# Altium project as14120_x31.PrjPCB (part 1 of 3)
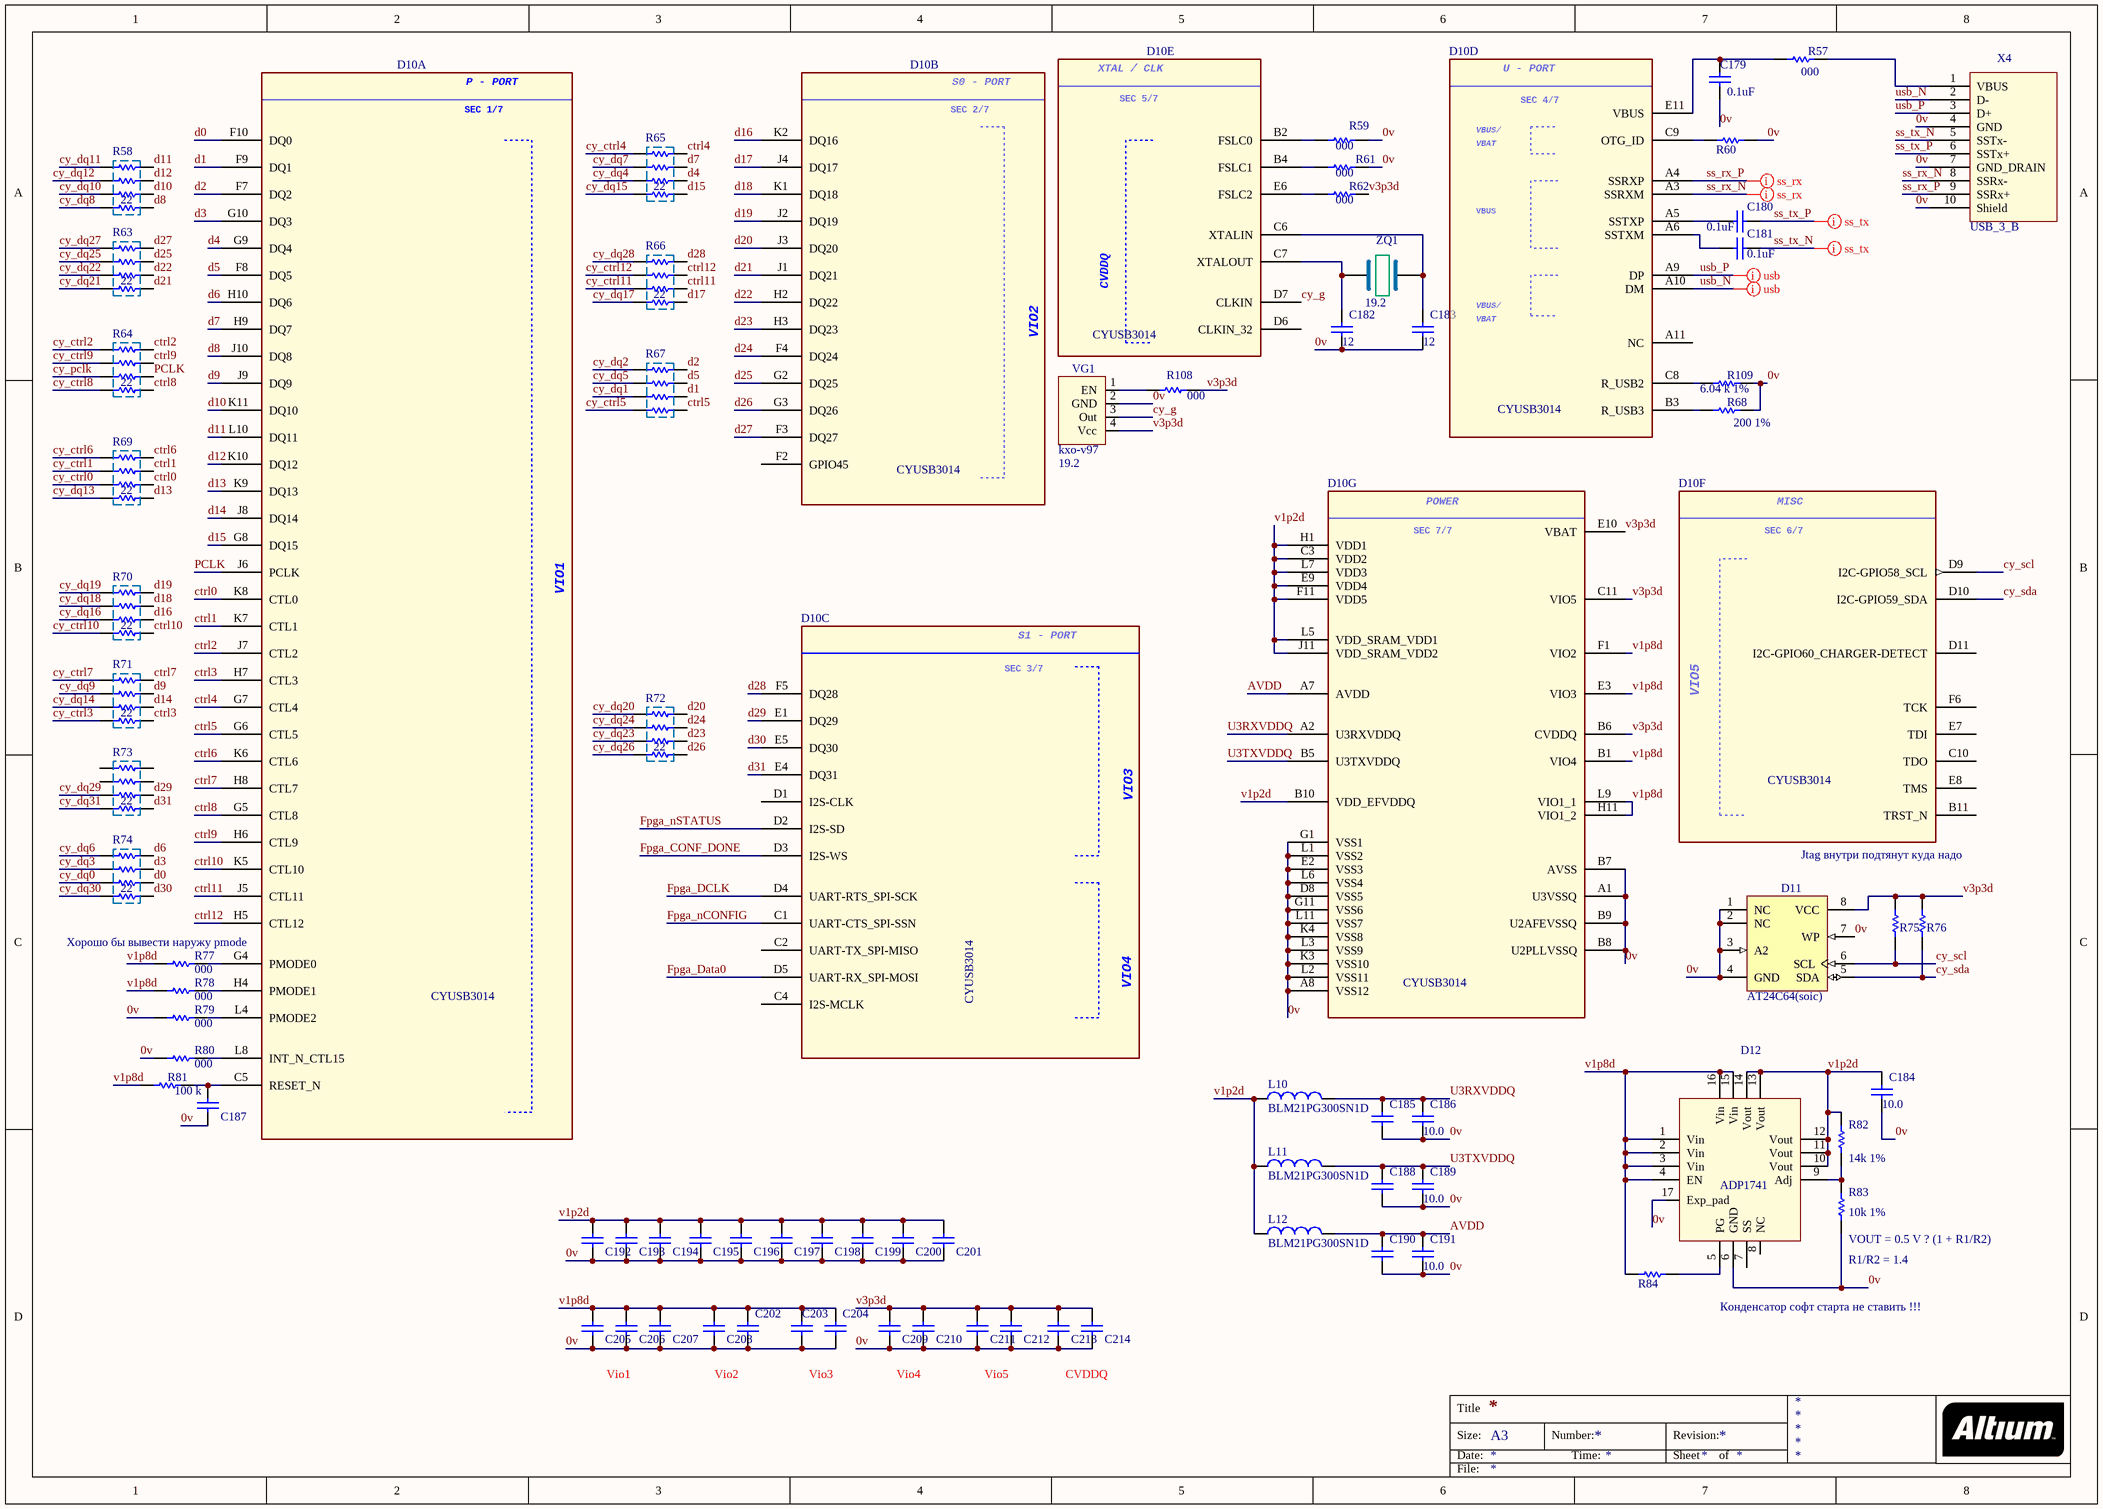
[diagram p0: as14120_x31_usb.SchDoc]
7 sheets, 344 parts. Net scope: global (net labels, ports and power ports of the same name join across sheets).
Board file: as_x31.PcbDoc
Sheets:
  as14120_x31_usb.SchDoc
  as14120_x31_fpga_ttl.SchDoc
  as14120_x31_fpga_power_conf.SchDoc
  as14120_x31_fpga_ddr.SchDoc
  as14120_x31_fpga_cypress.SchDoc
  as14120_x31_ddr.SchDoc
  as14120_x31_adc.SchDoc

## Sheet as14120_x31_usb.SchDoc
size A3; PageSetup: Record=PageOptions|CenterHorizontal=True|CenterVertical=True|PrintScale=1.02|XCorrection=1.00|YCorrection=1.00|PrintKind=0|BorderSize=5000000|LeftOffset=0|BottomOffset=0|Orientation=2|PaperLength=4200|PaperWidth=2970|Scale=100|PaperSource=7|PrintQuality=-4|MediaType=1|DitherType=10|PaperKind=A3 (бумага продольной резки) (297 x 420 мм)|PrintScaleMode=1

### Parts
C179  value 0.1uF  [CAPC0402(1005)60_M]  (hidden comment: CAP 1uF 10V 0402(1005))
C180  value 0.1uF  [CAPC0402(1005)60_M]  (hidden comment: CAP 1uF 10V 0402(1005))
C181  value 0.1uF  [CAPC0402(1005)60_M]  (hidden comment: CAP 1uF 10V 0402(1005))
C182  value 12  [CAPC0805(2012)100_N]  (hidden comment: CAP_0805)
C183  value 12  [CAPC0805(2012)100_N]  (hidden comment: CAP_0805)
C184  value 10.0  [CAPC0805(2012)100_N]  (hidden comment: CAP_0805)
C185  CAP 1uF 10V 0402(1005)  [CAPC0402(1005)60_M]  (value not drawn)
C186  value 10.0  [CAPC0805(2012)100_N]  (hidden comment: CAP_0805)
C187  CAP 1uF 10V 0402(1005)  [CAPC0402(1005)60_M]  (value not drawn)
C188  CAP 1uF 10V 0402(1005)  [CAPC0402(1005)60_M]  (value not drawn)
C189  value 10.0  [CAPC0805(2012)100_N]  (hidden comment: CAP_0805)
C190  CAP 1uF 10V 0402(1005)  [CAPC0402(1005)60_M]  (value not drawn)
C191  value 10.0  [CAPC0805(2012)100_N]  (hidden comment: CAP_0805)
C192  CAP 1uF 10V 0402(1005)  [CAPC0402(1005)60_M]  (value not drawn)
C193  CAP 1uF 10V 0402(1005)  [CAPC0402(1005)60_M]  (value not drawn)
C194  CAP 1uF 10V 0402(1005)  [CAPC0402(1005)60_M]  (value not drawn)
C195  CAP 1uF 10V 0402(1005)  [CAPC0402(1005)60_M]  (value not drawn)
C196  CAP 1uF 10V 0402(1005)  [CAPC0402(1005)60_M]  (value not drawn)
C197  CAP 1uF 10V 0402(1005)  [CAPC0402(1005)60_M]  (value not drawn)
C198  CAP 1uF 10V 0402(1005)  [CAPC0402(1005)60_M]  (value not drawn)
C199  CAP 1uF 10V 0402(1005)  [CAPC0402(1005)60_M]  (value not drawn)
C200  CAP 1uF 10V 0402(1005)  [CAPC0402(1005)60_M]  (value not drawn)
C201  CAP 1uF 10V 0402(1005)  [CAPC0402(1005)60_M]  (value not drawn)
C202  CAP 1uF 10V 0402(1005)  [CAPC0402(1005)60_M]  (value not drawn)
C203  CAP 1uF 10V 0402(1005)  [CAPC0402(1005)60_M]  (value not drawn)
C204  CAP 1uF 10V 0402(1005)  [CAPC0402(1005)60_M]  (value not drawn)
C205  CAP 1uF 10V 0402(1005)  [CAPC0402(1005)60_M]  (value not drawn)
C206  CAP 1uF 10V 0402(1005)  [CAPC0402(1005)60_M]  (value not drawn)
C207  CAP 1uF 10V 0402(1005)  [CAPC0402(1005)60_M]  (value not drawn)
C208  CAP 1uF 10V 0402(1005)  [CAPC0402(1005)60_M]  (value not drawn)
C209  CAP 1uF 10V 0402(1005)  [CAPC0402(1005)60_M]  (value not drawn)
C210  CAP 1uF 10V 0402(1005)  [CAPC0402(1005)60_M]  (value not drawn)
C211  CAP 1uF 10V 0402(1005)  [CAPC0402(1005)60_M]  (value not drawn)
C212  CAP 1uF 10V 0402(1005)  [CAPC0402(1005)60_M]  (value not drawn)
C213  CAP 1uF 10V 0402(1005)  [CAPC0402(1005)60_M]  (value not drawn)
C214  CAP 1uF 10V 0402(1005)  [CAPC0402(1005)60_M]  (value not drawn)
D10  CYUSB3014  [BGA121C80P11X11]  (parts A,B,C,D,E,F,G of 7)
D11  AT24C64(soic)  [8S1_N]
D12  ADP1741  [CP-16-4_N]
L10  BLM21PG300SN1D  [CAPC0805(2012)100_N]
L11  BLM21PG300SN1D  [CAPC0805(2012)100_N]
L12  BLM21PG300SN1D  [CAPC0805(2012)100_N]
R57  value 000  [RESC0805(2012)_L]  (hidden comment: 1K 1% 0805(2012))
R58  22  [CAY16]
R59  value 000  [RESC0603(1608)_L]  (hidden comment: 1K 5% 0603(1608))
R60  ???  [RESC0603(1608)_L]  (value not drawn)
R61  value 000  [RESC0603(1608)_L]  (hidden comment: 1K 5% 0603(1608))
R62  value 000  [RESC0603(1608)_L]  (hidden comment: 1K 5% 0603(1608))
R63  22  [CAY16]
R64  22  [CAY16]
R65  22  [CAY16]
R66  22  [CAY16]
R67  (no value)  [CAY16]
R68  value 200 1%  [RESC0805(2012)_L]  (hidden comment: 1K 1% 0805(2012))
R69  22  [CAY16]
R70  22  [CAY16]
R71  22  [CAY16]
R72  22  [CAY16]
R73  22  [CAY16]
R74  22  [CAY16]
R75  1K 5% 0603(1608)  [RESC0603(1608)_L]  (value not drawn)
R76  1K 5% 0603(1608)  [RESC0603(1608)_L]  (value not drawn)
R77  value 000  [RESC0603(1608)_L]  (hidden comment: 1K 5% 0603(1608))
R78  value 000  [RESC0603(1608)_L]  (hidden comment: 1K 5% 0603(1608))
R79  value 000  [RESC0603(1608)_L]  (hidden comment: 1K 5% 0603(1608))
R80  value 000  [RESC0603(1608)_L]  (hidden comment: 1K 5% 0603(1608))
R81  value 100 k  [RESC0603(1608)_L]  (hidden comment: 1K 5% 0603(1608))
R82  value 14k 1%  [RESC0805(2012)_L]  (hidden comment: 1K 1% 0805(2012))
R83  value 10k 1%  [RESC0805(2012)_L]  (hidden comment: 1K 1% 0805(2012))
R84  1K 5% 0603(1608)  [RESC0603(1608)_L]  (value not drawn)
R108  value 000  [RESC0603(1608)_L]  (hidden comment: 1K 5% 0603(1608))
R109  value 6.04 k 1%  [RESC0805(2012)_L]  (hidden comment: 1K 1% 0805(2012))
VG1  kxo-v97  value 19.2  [kxo-v97]
X4  USB_3_B  [USB3_B]
ZQ1  value 19.2  [BCY-W2/E4.7]  (hidden comment: Resonator)

### Nets
0v: C179.2 C182.1 C183.1 C184.1 C185.1 C186.1 C187.1 C188.1 C189.1 C190.1 C191.1 C192.1 C193.1 C194.1 C195.1 C196.1 C197.1 C198.1 C199.1 C200.1 C201.1 C202.1 C203.1 C204.1 C205.1 C206.1 C207.1 C208.1 C209.1 C210.1 C211.1 C212.1 C213.1 C214.1 D10.A1(U3VSSQ) D10.A8(VSS12) D10.B7(AVSS) D10.B8(U2PLLVSSQ) D10.B9(U2AFEVSSQ) D10.D8(VSS5) D10.E2(VSS3) D10.G1(VSS1) D10.G11(VSS6) D10.K3(VSS10) D10.K4(VSS8) D10.L1(VSS2) D10.L2(VSS11) D10.L3(VSS9) D10.L6(VSS4) D10.L11(VSS7) D11.1(NC) D11.2(NC) D11.3(A2) D11.4(GND) D11.7(WP) D12.6(GND) D12.17(Exp_pad) R59.1 R60.2 R61.1 R68.2 R79.2 R80.2 R83.1 R109.2 VG1.2(GND) X4.4(GND) X4.7(GND_DRAIN) X4.10(Shield)
AVDD: C190.2 C191.2 D10.A7(AVDD) L12.2
ctrl0: D10.K8(CTL0) R69.6
ctrl1: D10.K7(CTL1) R69.7
ctrl2: D10.J7(CTL2) R64.8
ctrl3: D10.H7(CTL3) R71.5
ctrl4: D10.G7(CTL4) R65.8
ctrl5: D10.G6(CTL5) R67.5
ctrl6: D10.K6(CTL6) R69.8
ctrl7: D10.H8(CTL7) R71.8
ctrl8: D10.G5(CTL8) R64.5
ctrl9: D10.H6(CTL9) R64.7
ctrl10: D10.K5(CTL10) R70.5
ctrl11: D10.J5(CTL11) R66.6
ctrl12: D10.H5(CTL12) R66.7
cy_ctrl0: R69.3
cy_ctrl1: R69.2
cy_ctrl2: R64.1
cy_ctrl3: R71.4
cy_ctrl4: R65.1
cy_ctrl5: R67.4
cy_ctrl6: R69.1
cy_ctrl7: R71.1
cy_ctrl8: R64.4
cy_ctrl9: R64.2
cy_ctrl10: R70.4
cy_ctrl11: R66.3
cy_ctrl12: R66.2
cy_dq0: R74.3
cy_dq1: R67.3
cy_dq2: R67.1
cy_dq3: R74.2
cy_dq4: R65.3
cy_dq5: R67.2
cy_dq6: R74.1
cy_dq7: R65.2
cy_dq8: R58.4
cy_dq9: R71.2
cy_dq10: R58.3
cy_dq11: R58.1
cy_dq12: R58.2
cy_dq13: R69.4
cy_dq14: R71.3
cy_dq15: R65.4
cy_dq16: R70.3
cy_dq17: R66.4
cy_dq18: R70.2
cy_dq19: R70.1
cy_dq20: R72.1
cy_dq21: R63.4
cy_dq22: R63.3
cy_dq23: R72.3
cy_dq24: R72.2
cy_dq25: R63.2
cy_dq26: R72.4
cy_dq27: R63.1
cy_dq28: R66.1
cy_dq29: R73.3
cy_dq30: R74.4
cy_dq31: R73.4
cy_g: D10.D7(CLKIN) VG1.3(Out)
cy_pclk: R64.3
cy_scl: D10.D9(I2C-GPIO58_SCL) D11.6(SCL) R75.1
cy_sda: D10.D10(I2C-GPIO59_SDA) D11.5(SDA) R76.1
d0: D10.F10(DQ0) R74.6
d1: D10.F9(DQ1) R67.6
d2: D10.F7(DQ2) R67.8
d3: D10.G10(DQ3) R74.7
d4: D10.G9(DQ4) R65.6
d5: D10.F8(DQ5) R67.7
d6: D10.H10(DQ6) R74.8
d7: D10.H9(DQ7) R65.7
d8: D10.J10(DQ8) R58.5
d9: D10.J9(DQ9) R71.7
d10: D10.K11(DQ10) R58.6
d11: D10.L10(DQ11) R58.8
d12: D10.K10(DQ12) R58.7
d13: D10.K9(DQ13) R69.5
d14: D10.J8(DQ14) R71.6
d15: D10.G8(DQ15) R65.5
d16: D10.K2(DQ16) R70.6
d17: D10.J4(DQ17) R66.5
d18: D10.K1(DQ18) R70.7
d19: D10.J2(DQ19) R70.8
d20: D10.J3(DQ20) R72.8
d21: D10.J1(DQ21) R63.5
d22: D10.H2(DQ22) R63.6
d23: D10.H3(DQ23) R72.6
d24: D10.F4(DQ24) R72.7
d25: D10.G2(DQ25) R63.7
d26: D10.G3(DQ26) R72.5
d27: D10.F3(DQ27) R63.8
d28: D10.F5(DQ28) R66.8
d29: D10.E1(DQ29) R73.6
d30: D10.E5(DQ30) R74.5
d31: D10.E4(DQ31) R73.5
Fpga_CONF_DONE: D10.D3(I2S-WS)
Fpga_Data0: D10.D5(UART-RX_SPI-MOSI)
Fpga_DCLK: D10.D4(UART-RTS_SPI-SCK)
Fpga_nCONFIG: D10.C1(UART-CTS_SPI-SSN)
Fpga_nSTATUS: D10.D2(I2S-SD)
PCLK: D10.J6(PCLK) R64.6
ss_rx_N: D10.A3(SSRXM) X4.8(SSRx-)
ss_rx_P: D10.A4(SSRXP) X4.9(SSRx+)
ss_tx_N: C181.1 X4.5(SSTx-)
ss_tx_P: C180.1 X4.6(SSTx+)
U3RXVDDQ: C185.2 C186.2 D10.A2(U3RXVDDQ) L10.2
U3TXVDDQ: C188.2 C189.2 D10.B5(U3TXVDDQ) L11.2
usb_N: D10.A10(DM) X4.2(D-)
usb_P: D10.A9(DP) X4.3(D+)
v1p2d: C184.2 C192.2 C193.2 C194.2 C195.2 C196.2 C197.2 C198.2 C199.2 C200.2 C201.2 D10.B10(VDD_EFVDDQ) D10.C3(VDD2) D10.E9(VDD4) D10.F11(VDD5) D10.H1(VDD1) D10.J11(VDD_SRAM_VDD2) D10.L5(VDD_SRAM_VDD1) D10.L7(VDD3) D12.10(Vout) D12.11(Vout) D12.12(Vout) D12.13(Vout) D12.14(Vout) L10.1 L11.1 L12.1 R82.2
v1p8d: C202.2 C203.2 C204.2 C205.2 C206.2 C207.2 C208.2 D10.B1(VIO4) D10.E3(VIO3) D10.F1(VIO2) D10.H11(VIO1_2) D10.L9(VIO1_1) D12.1(Vin) D12.2(Vin) D12.3(Vin) D12.4(EN) D12.15(Vin) D12.16(Vin) R77.2 R78.2 R81.2 R84.2
v3p3d: C209.2 C210.2 C211.2 C212.2 C213.2 C214.2 D10.B6(CVDDQ) D10.C11(VIO5) D10.E10(VBAT) D11.8(VCC) R62.1 R75.2 R76.2 R108.1 VG1.4(Vcc)
NetC179_1: C179.1 D10.E11(VBUS) R57.1
NetC180_2: C180.2 D10.A5(SSTXP)
NetC181_2: C181.2 D10.A6(SSTXM)
NetC182_2: C182.2 D10.C7(XTALOUT) ZQ1.1
NetC183_2: C183.2 D10.C6(XTALIN) ZQ1.2
NetC187_2: C187.2 D10.C5(RESET_N) R81.1
NetD10_B2: D10.B2(FSLC0) R59.2
NetD10_B3: D10.B3(R_USB3) R68.1
NetD10_B4: D10.B4(FSLC1) R61.2
NetD10_C8: D10.C8(R_USB2) R109.1
NetD10_C9: D10.C9(OTG_ID) R60.1
NetD10_E6: D10.E6(FSLC2) R62.2
NetD10_G4: D10.G4(PMODE0) R77.1
NetD10_H4: D10.H4(PMODE1) R78.1
NetD10_L4: D10.L4(PMODE2) R79.1
NetD10_L8: D10.L8(INT_N_CTL15) R80.1
NetD12_5: D12.5(PG) R84.1
NetD12_9: D12.9(Adj) R82.1 R83.2
NetR57_2: R57.2 X4.1(VBUS)
NetR108_2: R108.2 VG1.1(EN)

Not connected (* = marked no-connect by the designer): D10 A11(NC) B11(TRST_N) C2(UART-TX_SPI-MISO) C4(I2S-MCLK) C10(TDO) D1(I2S-CLK) D6(CLKIN_32) D11(I2C-GPIO60_CHARGER-DETECT) E7(TDI) E8(TMS) F2(GPIO45) F6(TCK); D12 7(SS) 8(NC); R73 1 2 7 8

### Layout directives
differential pair: ss_rx_N, ss_rx_P, ss_tx_N, ss_tx_P, usb_N, usb_P

### Notes on the sheet
- Jtag внутри подтянут куда надо
- Хорошо бы вывести наружу pmode
- (near R83) VOUT = 0.5 V ? (1 + R1/R2)
- R1/R2 = 1.4
- Конденсатор софт старта не ставить !!!
- Vio1
- Vio2
- Vio3
- Vio4
- Vio5
- CVDDQ
- Title
- Size:
- Date:
- A3
- Number:
- Time:
- Revision:
- Sheet
- of
- File:
- (in symbol CYUSB3014-BZXC, part A) P - PORT; SEC 1/7; VIO1
- (in symbol CYUSB3014-BZXC, part B) S0 - PORT; SEC 2/7
- (in symbol CYUSB3014-BZXC, part C) S1 - PORT; SEC 3/7
- (in symbol CYUSB3014-BZXC, part D) U - PORT; SEC 4/7; VBUS/
- (in symbol CYUSB3014-BZXC, part E) XTAL / CLK; SEC 5/7
- (in symbol CYUSB3014-BZXC, part F) MISC; SEC 6/7
- (in symbol CYUSB3014-BZXC, part G) POWER; SEC 7/7

### Library data of the parts
C179-C181 C185 C187 C188 C190 C192-C214 = CAP_0402: CAP 1uF 10V ±20% 0402 (1005 Metric) Thickness 0.6mm SMD; Case-Metric: 1005; Case-EIA: 0402; Tolerance: ±20%; Max Thickness: 0.6 mm; Rated Voltage: 10 V; Technology: SMT
  C185 C187 C188 C190 C192-C214: Value: 1uF
D10 = CYUSB3014-BZXC
D11 = AT24C08BN-SP25-T: 8Kbit (1024 x 8), 2-wire Bus Automotive Serial EEPROM with Write Protect, 2.5V, 8-Pin SOIC, Tape & Reel; DatasheetVersion: 8517C,  Jan-2009; PackageVersion: revC, Mar-2005; PackageReference: 8S1; PackageDescription: 8-Lead (0.150" Wide Body), Plastic Gull Wing Small Outline (JEDEC SOIC); Code_JEDEC: MS-012-AA; Code_IPC: SOIC127P600-8; ComponentLink1Description: Manufacturer URL; ComponentLink1URL: http://www.atmel.com/; ComponentLink2Description: Datasheet; ComponentLink2URL: http://www.atmel.com/dyn/resources/prod_documents/doc8517.pdf
L10-L12 = Ferrite_beat
R57 R68 R82 R83 R109 = RES_0805: 1K 0.125W 1% 0805 (2012 Metric)  SMD; Case-Metric: 2012; Case-EIA: 0805; Tolerance: 1 %; Power: 0.125 W; Technology: SMT
R58 R63-R67 R69-R74 = cay16-J4
  R58 R63-R66 R69-R74: Value: 22
R59-R62 R77-R81 R108 = RES_0603: 1K 0.1W 5% 0603 (1608 Metric)  SMD; Case-EIA: 0603; Case-Metric: 1608; Technology: SMT; Tolerance: 5 %; Power: 0.1 W
  R60: Value: ???
R75 R76 = RES_0603: 1K 0.1W 5% 0603 (1608 Metric)  SMD; Case-EIA: 0603; Case-Metric: 1608; Value: 2.2 k; Technology: SMT; Tolerance: 5 %; Power: 0.1 W
R84 = RES_0603: 1K 0.1W 5% 0603 (1608 Metric)  SMD; Case-EIA: 0603; Case-Metric: 1608; Value: 100k; Technology: SMT; Tolerance: 5 %; Power: 0.1 W

## Sheet as14120_x31_fpga_ttl.SchDoc
size A3; PageSetup: Record=PageOptions|CenterHorizontal=True|CenterVertical=True|PrintScale=1.00|XCorrection=1.00|YCorrection=1.00|PrintKind=1|BorderSize=5000000|LeftOffset=0|BottomOffset=0|Orientation=2|PaperLength=1000|PaperWidth=1000|Scale=100|PaperSource=7|PrintQuality=-4|MediaType=1|DitherType=10|PaperKind=A4 (210 x 297 мм)|PrintScaleMode=1
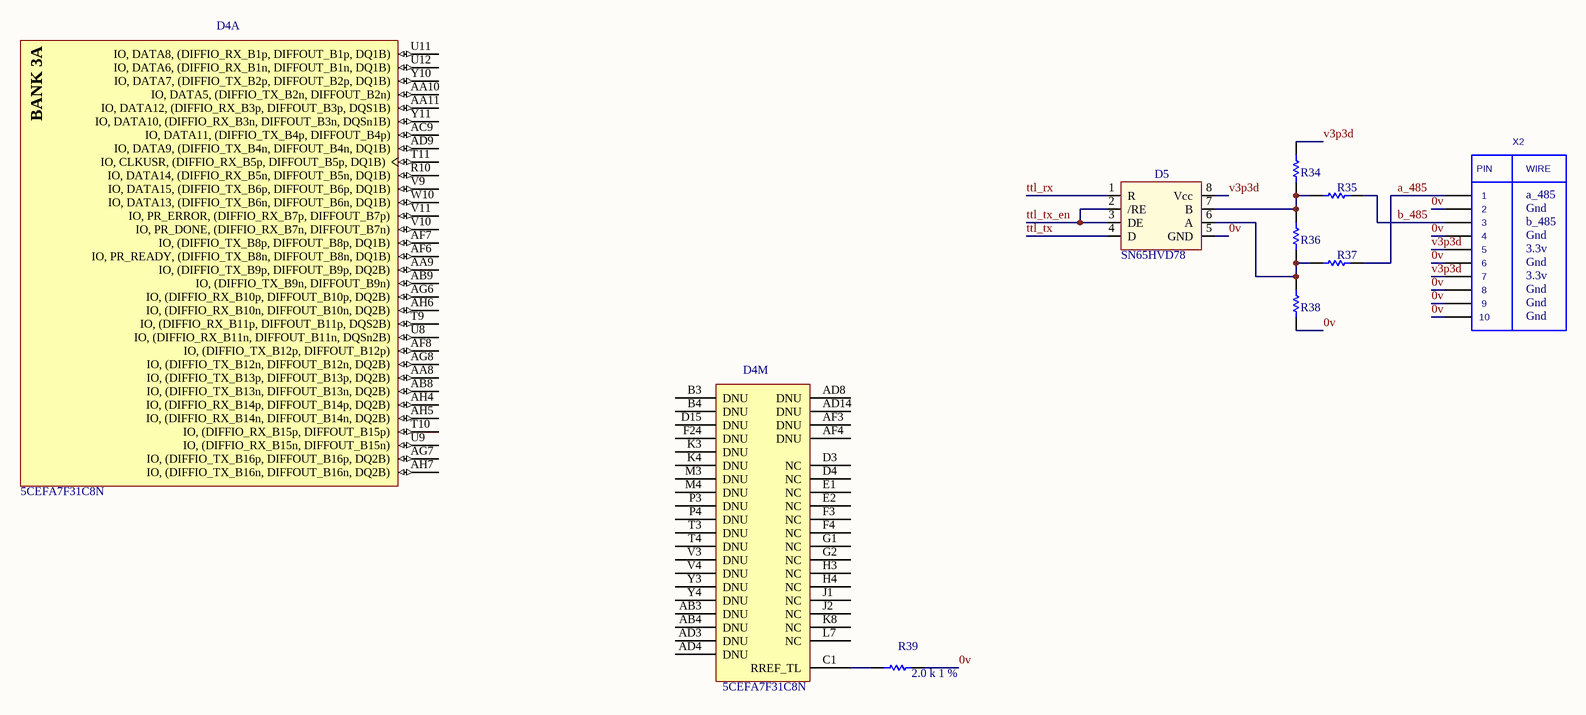
[diagram p1: as14120_x31_fpga_ttl.SchDoc]

### Parts
D4  5CEFA7F31C8N  [ALTR-896-FBGA-2000A]  (parts A,M of 13)
D5  SN65HVD78  [8S1_M]
R34  1K 1% 0805(2012)  [RESC0805(2012)_L]  (value not drawn)
R35  1K 1% 0805(2012)  [RESC0805(2012)_L]  (value not drawn)
R36  1K 1% 0805(2012)  [RESC0805(2012)_L]  (value not drawn)
R37  1K 1% 0805(2012)  [RESC0805(2012)_L]  (value not drawn)
R38  1K 1% 0805(2012)  [RESC0805(2012)_L]  (value not drawn)
R39  value 2.0 k  Tolerance: 1 %  [RESC0805(2012)_L]  (hidden comment: 1K 1% 0805(2012))
X2  IDC10  [IDC10M]  (value not drawn)

### Nets
0v: D5.5(GND) R38.1 R39.2 X2.2 X2.4 X2.6 X2.8 X2.9 X2.10
a_485: R37.2 X2.1
b_485: R35.2 X2.3
ttl_rx: D5.1(R)
ttl_tx: D5.4(D)
ttl_tx_en: D5.2(/RE) D5.3(DE)
v3p3d: D5.8(Vcc) R34.2 X2.5 X2.7
NetD4_C1: D4.C1(RREF_TL) R39.1
NetD5_6: D5.6(A) R36.1 R37.1 R38.2
NetD5_7: D5.7(B) R34.1 R35.1 R36.2

Not connected (* = marked no-connect by the designer): D4 AA8(IO,_(DIFFIO_TX_B13p,_DIFFOUT_B13p,_DQ2B)) AA9(IO,_(DIFFIO_TX_B9p,_DIFFOUT_B9p,_DQ2B)) AA10(IO,_DATA5,_(DIFFIO_TX_B2n,_DIFFOUT_B2n)) AA11(IO,_DATA12,_(DIFFIO_RX_B3p,_DIFFOUT_B3p,_DQS1B)) AB3(DNU) AB4(DNU) AB8(IO,_(DIFFIO_TX_B13n,_DIFFOUT_B13n,_DQ2B)) AB9(IO,_(DIFFIO_TX_B9n,_DIFFOUT_B9n)) AC9(IO,_DATA11,_(DIFFIO_TX_B4p,_DIFFOUT_B4p)) AD3(DNU) AD4(DNU) AD8(DNU) AD9(IO,_DATA9,_(DIFFIO_TX_B4n,_DIFFOUT_B4n,_DQ1B)) AD14(DNU) AF3(DNU) AF4(DNU) AF6(IO,_PR_READY,_(DIFFIO_TX_B8n,_DIFFOUT_B8n,_DQ1B)) AF7(IO,_(DIFFIO_TX_B8p,_DIFFOUT_B8p,_DQ1B)) AF8(IO,_(DIFFIO_TX_B12p,_DIFFOUT_B12p)) AG6(IO,_(DIFFIO_RX_B10p,_DIFFOUT_B10p,_DQ2B)) AG7(IO,_(DIFFIO_TX_B16p,_DIFFOUT_B16p,_DQ2B)) AG8(IO,_(DIFFIO_TX_B12n,_DIFFOUT_B12n,_DQ2B)) AH4(IO,_(DIFFIO_RX_B14p,_DIFFOUT_B14p,_DQ2B)) AH5(IO,_(DIFFIO_RX_B14n,_DIFFOUT_B14n,_DQ2B)) AH6(IO,_(DIFFIO_RX_B10n,_DIFFOUT_B10n,_DQ2B)) AH7(IO,_(DIFFIO_TX_B16n,_DIFFOUT_B16n,_DQ2B)) B3(DNU) B4(DNU) D3(NC) D4(NC) D15(DNU) E1(NC) E2(NC) F3(NC) F4(NC) F24(DNU) G1(NC) G2(NC) H3(NC) H4(NC) J1(NC) J2(NC) K3(DNU) K4(DNU) K8(NC) L7(NC) M3(DNU) M4(DNU) P3(DNU) P4(DNU) R10(IO,_DATA14,_(DIFFIO_RX_B5n,_DIFFOUT_B5n,_DQ1B)) T3(DNU) T4(DNU) T9(IO,_(DIFFIO_RX_B11p,_DIFFOUT_B11p,_DQS2B)) T10(IO,_(DIFFIO_RX_B15p,_DIFFOUT_B15p)) T11(IO,_CLKUSR,_(DIFFIO_RX_B5p,_DIFFOUT_B5p,_DQ1B)) U8(IO,_(DIFFIO_RX_B11n,_DIFFOUT_B11n,_DQSn2B)) U9(IO,_(DIFFIO_RX_B15n,_DIFFOUT_B15n)) U11(IO,_DATA8,_(DIFFIO_RX_B1p,_DIFFOUT_B1p,_DQ1B)) U12(IO,_DATA6,_(DIFFIO_RX_B1n,_DIFFOUT_B1n,_DQ1B)) V3(DNU) V4(DNU) V9(IO,_DATA15,_(DIFFIO_TX_B6p,_DIFFOUT_B6p,_DQ1B)) V10(IO,_PR_DONE,_(DIFFIO_RX_B7n,_DIFFOUT_B7n)) V11(IO,_PR_ERROR,_(DIFFIO_RX_B7p,_DIFFOUT_B7p)) W10(IO,_DATA13,_(DIFFIO_TX_B6n,_DIFFOUT_B6n,_DQ1B)) Y3(DNU) Y4(DNU) Y10(IO,_DATA7,_(DIFFIO_TX_B2p,_DIFFOUT_B2p,_DQ1B)) Y11(IO,_DATA10,_(DIFFIO_RX_B3n,_DIFFOUT_B3n,_DQSn1B))

### Notes on the sheet
- a_485
- b_485
- 3.3v
- Gnd
- Title
- Size:
- Date:
- A3
- Number:
- Time:
- Revision:
- Sheet
- of
- File:
- (in symbol 5CEFA7F31C8N, part A) BANK 3A
- (in symbol IDC10) PIN; WIRE

### Library data of the parts
D4 = 5CEFA7F31C8N: Cyclone V E Family FPGA, 1.07 to 1.13 V Supply, 480 I/O Pins, 7 PLLs, 896-Pin FBGA, Speed Grade 8, Commercial Grade, RoHS Compliant; Manufacturer: Altera; Device Group: 5CEFA7; GPIO: 480; Logic Elements (LE) (K): 149.5; Speed Grade: 8; DatasheetVersion: Rev. 3.1; PackageReference: 896-FBGA-2000A; PackageDescription: 896-Pin FineLine Ball-Grid Array (FBGA), Body 31 x 31 mm, Pitch 1 mm; Supplier 1: Digi-Key; Supplier Part Number 1: 544-2768-ND; Supplier 2: Mouser; Supplier Part Number 2: 989-5CEFA7F31C8N; RoHS: RoHS Compliant; Subcategory: Cyclone V E; Voltage Supply: 1.07 to 1.13 V; Mounting Technology: Surface Mount; Code_JEDEC: MS-034-AAN-1; PartNumber: 5CEFA7F31C8N; ComponentLink1Description: Manufacturer URL; ComponentLink1URL: http://www.altera.com; ComponentLink2Description: Datasheet; ComponentLink2URL: http://www.altera.com/literature/hb/cyclone-v/cv_51002.pdf; ComponentLink3Description: Package Specification; ComponentLink3URL: http://www.altera.com/devicepackaging/04R00435-01.pdf; ComponentLink4Description: Device Handbook URL; ComponentLink4URL: http://www.altera.com/literature/hb/cyclone-v/cyclone5_handbook.pdf; ComponentLink5Description: Device Overview URL; ComponentLink5URL: http://www.altera.com/literature/hb/cyclone-v/cv_51001.pdf; ComponentLink6Description: Device Pin-Out URL; ComponentLink6URL: http://www.altera.com/literature/dp/cyclone-v/1.1.txt; ComponentLink7Description: Product URL; ComponentLink7URL: http://www.buyaltera.com/scripts/partsearch.dll?Detail&name=5CEFA7F31C8N-ND
R34 R38 = RES_0805: 1K 0.125W 1% 0805 (2012 Metric)  SMD; Case-Metric: 2012; Value: 1.1 k; Case-EIA: 0805; Tolerance: 1 %; Power: 0.125 W; Technology: SMT
R35 R37 = RES_0805: 1K 0.125W 1% 0805 (2012 Metric)  SMD; Case-Metric: 2012; Value: 33; Case-EIA: 0805; Tolerance: 1 %; Power: 0.125 W; Technology: SMT
R36 = RES_0805: 1K 0.125W 1% 0805 (2012 Metric)  SMD; Case-Metric: 2012; Value: 120; Case-EIA: 0805; Tolerance: 1 %; Power: 0.125 W; Technology: SMT
R39 = RES_0805: as R57 on sheet as14120_x31_usb; Power: 0.125 W; Technology: SMT
X2 = IDC10: Value: *

## Sheet as14120_x31_fpga_power_conf.SchDoc
size A2
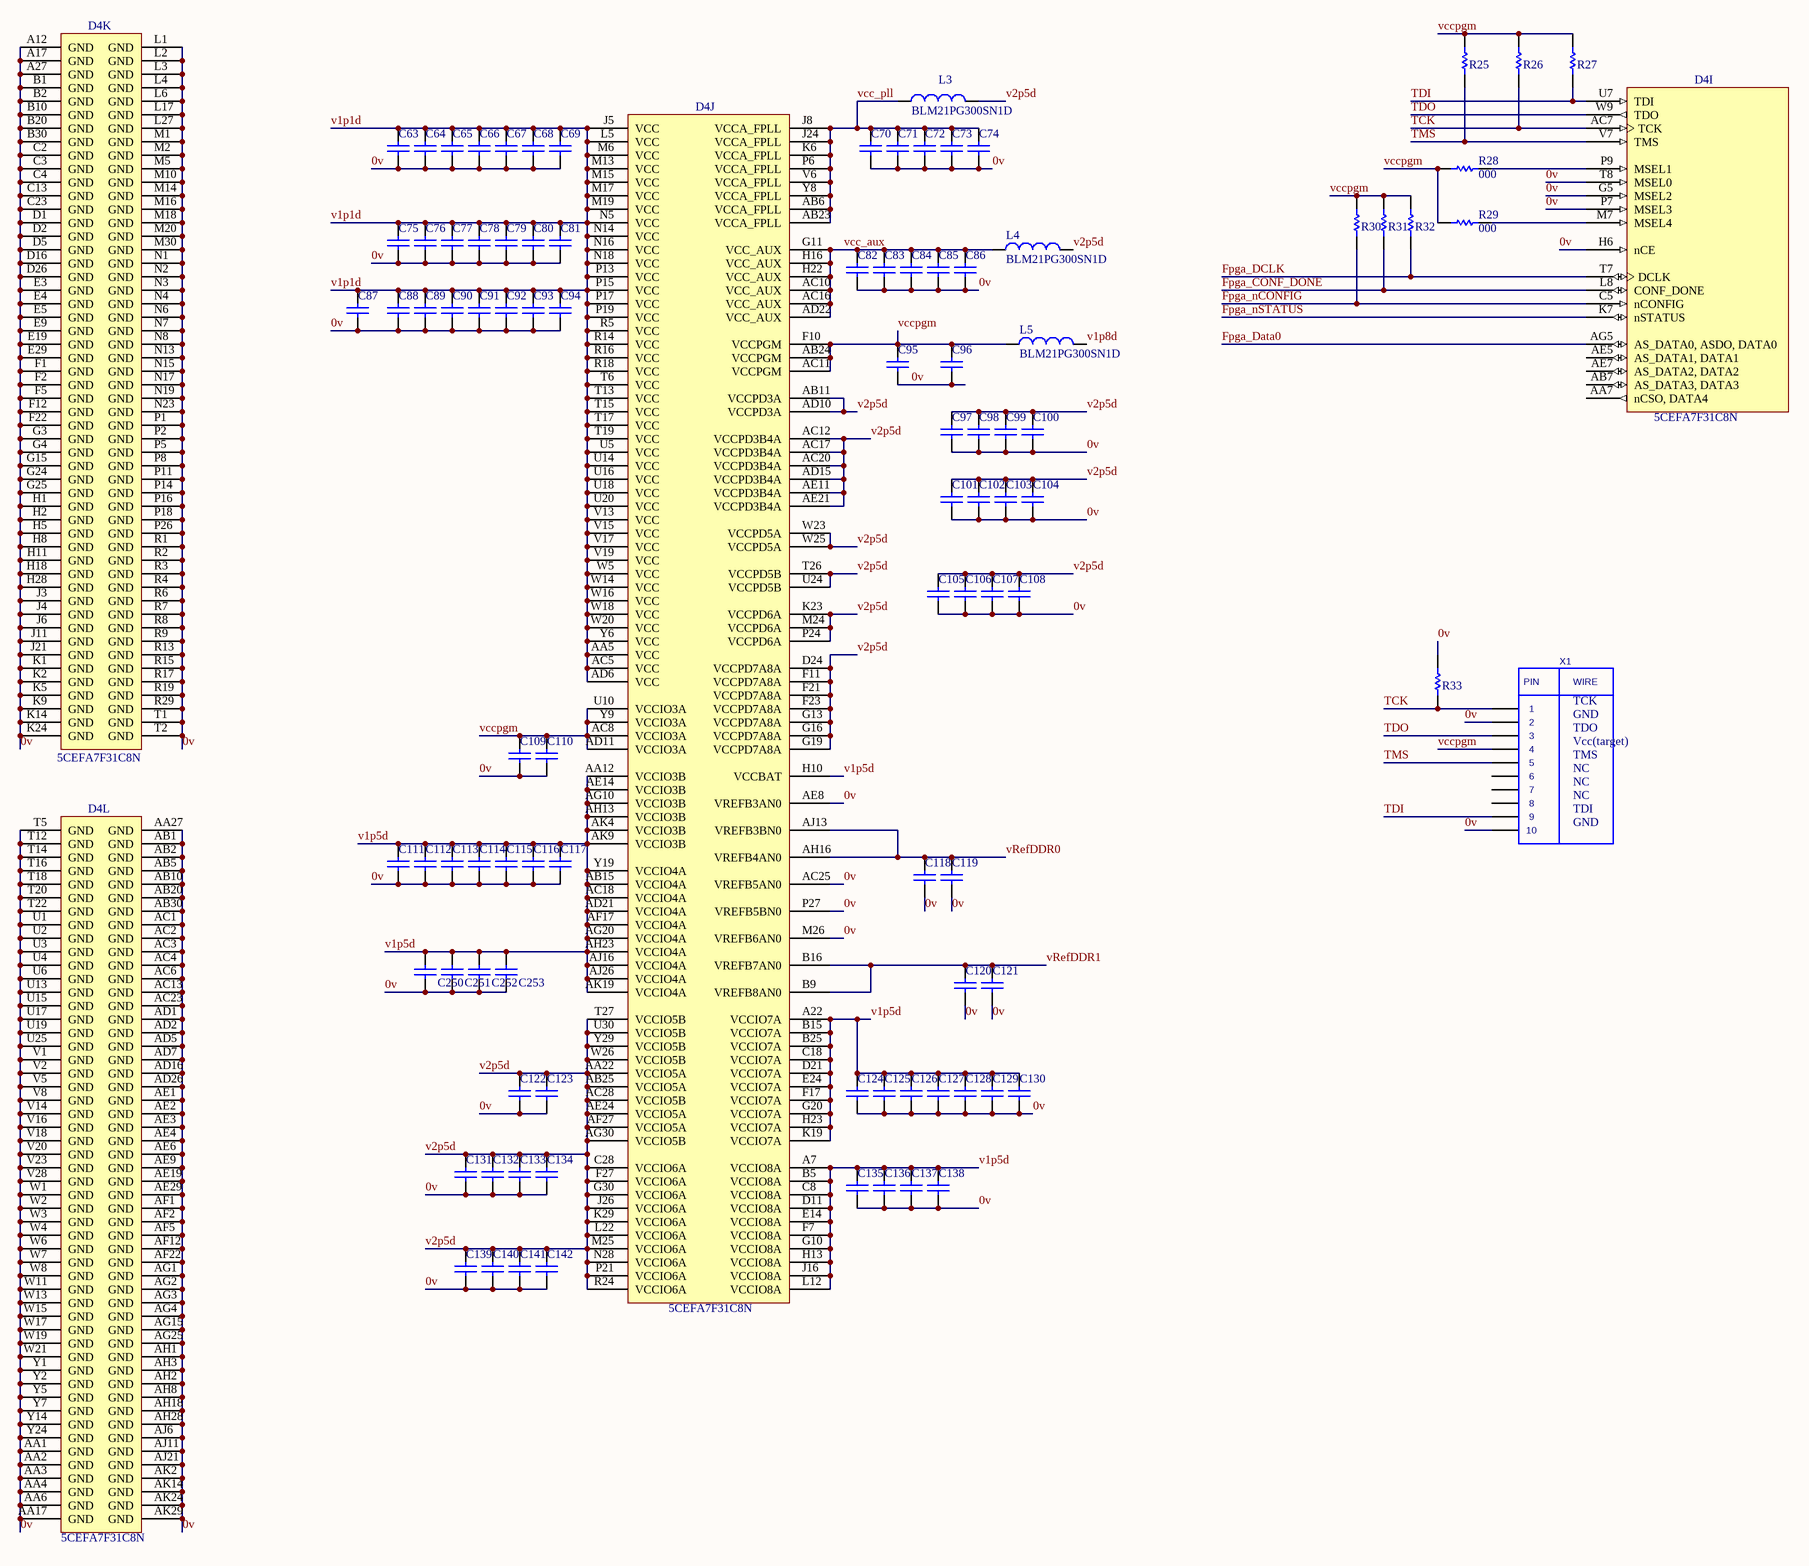
[diagram p2: as14120_x31_fpga_power_conf.SchDoc]

### Parts
C63  CAP 1uF 10V 0402(1005)  [CAPC0402(1005)60_M]  (value not drawn)
C64  CAP 1uF 10V 0402(1005)  [CAPC0402(1005)60_M]  (value not drawn)
C65  CAP 1uF 10V 0402(1005)  [CAPC0402(1005)60_M]  (value not drawn)
C66  CAP 1uF 10V 0402(1005)  [CAPC0402(1005)60_M]  (value not drawn)
C67  CAP 1uF 10V 0402(1005)  [CAPC0402(1005)60_M]  (value not drawn)
C68  CAP 1uF 10V 0402(1005)  [CAPC0402(1005)60_M]  (value not drawn)
C69  CAP 1uF 10V 0402(1005)  [CAPC0402(1005)60_M]  (value not drawn)
C70  CAP 1uF 10V 0402(1005)  [CAPC0402(1005)60_M]  (value not drawn)
C71  CAP 1uF 10V 0402(1005)  [CAPC0402(1005)60_M]  (value not drawn)
C72  CAP 1uF 10V 0402(1005)  [CAPC0402(1005)60_M]  (value not drawn)
C73  CAP 1uF 10V 0402(1005)  [CAPC0402(1005)60_M]  (value not drawn)
C74  CAP 1uF 10V 0402(1005)  [CAPC0402(1005)60_M]  (value not drawn)
C75  CAP 1uF 10V 0402(1005)  [CAPC0402(1005)60_M]  (value not drawn)
C76  CAP 1uF 10V 0402(1005)  [CAPC0402(1005)60_M]  (value not drawn)
C77  CAP 1uF 10V 0402(1005)  [CAPC0402(1005)60_M]  (value not drawn)
C78  CAP 1uF 10V 0402(1005)  [CAPC0402(1005)60_M]  (value not drawn)
C79  CAP 1uF 10V 0402(1005)  [CAPC0402(1005)60_M]  (value not drawn)
C80  CAP 1uF 10V 0402(1005)  [CAPC0402(1005)60_M]  (value not drawn)
C81  CAP 1uF 10V 0402(1005)  [CAPC0402(1005)60_M]  (value not drawn)
C82  CAP 1uF 10V 0402(1005)  [CAPC0402(1005)60_M]  (value not drawn)
C83  CAP 1uF 10V 0402(1005)  [CAPC0402(1005)60_M]  (value not drawn)
C84  CAP 1uF 10V 0402(1005)  [CAPC0402(1005)60_M]  (value not drawn)
C85  CAP 1uF 10V 0402(1005)  [CAPC0402(1005)60_M]  (value not drawn)
C86  CAP 1uF 10V 0402(1005)  [CAPC0402(1005)60_M]  (value not drawn)
C87  CAP 1uF 10V 0402(1005)  [CAPC0402(1005)60_M]  (value not drawn)
C88  CAP 1uF 10V 0402(1005)  [CAPC0402(1005)60_M]  (value not drawn)
C89  CAP 1uF 10V 0402(1005)  [CAPC0402(1005)60_M]  (value not drawn)
C90  CAP 1uF 10V 0402(1005)  [CAPC0402(1005)60_M]  (value not drawn)
C91  CAP 1uF 10V 0402(1005)  [CAPC0402(1005)60_M]  (value not drawn)
C92  CAP 1uF 10V 0402(1005)  [CAPC0402(1005)60_M]  (value not drawn)
C93  CAP 1uF 10V 0402(1005)  [CAPC0402(1005)60_M]  (value not drawn)
C94  CAP 1uF 10V 0402(1005)  [CAPC0402(1005)60_M]  (value not drawn)
C95  CAP 1uF 10V 0402(1005)  [CAPC0402(1005)60_M]  (value not drawn)
C96  CAP 1uF 10V 0402(1005)  [CAPC0402(1005)60_M]  (value not drawn)
C97  CAP 1uF 10V 0402(1005)  [CAPC0402(1005)60_M]  (value not drawn)
C98  CAP 1uF 10V 0402(1005)  [CAPC0402(1005)60_M]  (value not drawn)
C99  CAP 1uF 10V 0402(1005)  [CAPC0402(1005)60_M]  (value not drawn)
C100  CAP 1uF 10V 0402(1005)  [CAPC0402(1005)60_M]  (value not drawn)
C101  CAP 1uF 10V 0402(1005)  [CAPC0402(1005)60_M]  (value not drawn)
C102  CAP 1uF 10V 0402(1005)  [CAPC0402(1005)60_M]  (value not drawn)
C103  CAP 1uF 10V 0402(1005)  [CAPC0402(1005)60_M]  (value not drawn)
C104  CAP 1uF 10V 0402(1005)  [CAPC0402(1005)60_M]  (value not drawn)
C105  CAP 1uF 10V 0402(1005)  [CAPC0402(1005)60_M]  (value not drawn)
C106  CAP 1uF 10V 0402(1005)  [CAPC0402(1005)60_M]  (value not drawn)
C107  CAP 1uF 10V 0402(1005)  [CAPC0402(1005)60_M]  (value not drawn)
C108  CAP 1uF 10V 0402(1005)  [CAPC0402(1005)60_M]  (value not drawn)
C109  CAP 1uF 10V 0402(1005)  [CAPC0402(1005)60_M]  (value not drawn)
C110  CAP 1uF 10V 0402(1005)  [CAPC0402(1005)60_M]  (value not drawn)
C111  CAP 1uF 10V 0402(1005)  [CAPC0402(1005)60_M]  (value not drawn)
C112  CAP 1uF 10V 0402(1005)  [CAPC0402(1005)60_M]  (value not drawn)
C113  CAP 1uF 10V 0402(1005)  [CAPC0402(1005)60_M]  (value not drawn)
C114  CAP 1uF 10V 0402(1005)  [CAPC0402(1005)60_M]  (value not drawn)
C115  CAP 1uF 10V 0402(1005)  [CAPC0402(1005)60_M]  (value not drawn)
C116  CAP 1uF 10V 0402(1005)  [CAPC0402(1005)60_M]  (value not drawn)
C117  CAP 1uF 10V 0402(1005)  [CAPC0402(1005)60_M]  (value not drawn)
C118  CAP 1uF 10V 0402(1005)  [CAPC0402(1005)60_M]  (value not drawn)
C119  CAP 1uF 10V 0402(1005)  [CAPC0402(1005)60_M]  (value not drawn)
C120  CAP 1uF 10V 0402(1005)  [CAPC0402(1005)60_M]  (value not drawn)
C121  CAP 1uF 10V 0402(1005)  [CAPC0402(1005)60_M]  (value not drawn)
C122  CAP 1uF 10V 0402(1005)  [CAPC0402(1005)60_M]  (value not drawn)
C123  CAP 1uF 10V 0402(1005)  [CAPC0402(1005)60_M]  (value not drawn)
C124  CAP 1uF 10V 0402(1005)  [CAPC0402(1005)60_M]  (value not drawn)
C125  CAP 1uF 10V 0402(1005)  [CAPC0402(1005)60_M]  (value not drawn)
C126  CAP 1uF 10V 0402(1005)  [CAPC0402(1005)60_M]  (value not drawn)
C127  CAP 1uF 10V 0402(1005)  [CAPC0402(1005)60_M]  (value not drawn)
C128  CAP 1uF 10V 0402(1005)  [CAPC0402(1005)60_M]  (value not drawn)
C129  CAP 1uF 10V 0402(1005)  [CAPC0402(1005)60_M]  (value not drawn)
C130  CAP 1uF 10V 0402(1005)  [CAPC0402(1005)60_M]  (value not drawn)
C131  CAP 1uF 10V 0402(1005)  [CAPC0402(1005)60_M]  (value not drawn)
C132  CAP 1uF 10V 0402(1005)  [CAPC0402(1005)60_M]  (value not drawn)
C133  CAP 1uF 10V 0402(1005)  [CAPC0402(1005)60_M]  (value not drawn)
C134  CAP 1uF 10V 0402(1005)  [CAPC0402(1005)60_M]  (value not drawn)
C135  CAP 1uF 10V 0402(1005)  [CAPC0402(1005)60_M]  (value not drawn)
C136  CAP 1uF 10V 0402(1005)  [CAPC0402(1005)60_M]  (value not drawn)
C137  CAP 1uF 10V 0402(1005)  [CAPC0402(1005)60_M]  (value not drawn)
C138  CAP 1uF 10V 0402(1005)  [CAPC0402(1005)60_M]  (value not drawn)
C139  CAP 1uF 10V 0402(1005)  [CAPC0402(1005)60_M]  (value not drawn)
C140  CAP 1uF 10V 0402(1005)  [CAPC0402(1005)60_M]  (value not drawn)
C141  CAP 1uF 10V 0402(1005)  [CAPC0402(1005)60_M]  (value not drawn)
C142  CAP 1uF 10V 0402(1005)  [CAPC0402(1005)60_M]  (value not drawn)
C250  CAP 1uF 10V 0402(1005)  [CAPC0402(1005)60_M]  (value not drawn)
C251  CAP 1uF 10V 0402(1005)  [CAPC0402(1005)60_M]  (value not drawn)
C252  CAP 1uF 10V 0402(1005)  [CAPC0402(1005)60_M]  (value not drawn)
C253  CAP 1uF 10V 0402(1005)  [CAPC0402(1005)60_M]  (value not drawn)
D4  5CEFA7F31C8N  [ALTR-896-FBGA-2000A]  (parts I,J,K,L of 13)
L3  BLM21PG300SN1D  [CAPC0805(2012)100_N]
L4  BLM21PG300SN1D  [CAPC0805(2012)100_N]
L5  BLM21PG300SN1D  [CAPC0805(2012)100_N]
R25  1K 5% 0603(1608)  [RESC0603(1608)_L]  (value not drawn)
R26  1K 5% 0603(1608)  [RESC0603(1608)_L]  (value not drawn)
R27  1K 5% 0603(1608)  [RESC0603(1608)_L]  (value not drawn)
R28  value 000  [RESC0603(1608)_L]  (hidden comment: 1K 5% 0603(1608))
R29  value 000  [RESC0603(1608)_L]  (hidden comment: 1K 5% 0603(1608))
R30  1K 5% 0603(1608)  [RESC0603(1608)_L]  (value not drawn)
R31  1K 5% 0603(1608)  [RESC0603(1608)_L]  (value not drawn)
R32  1K 5% 0603(1608)  [RESC0603(1608)_L]  (value not drawn)
R33  1K 5% 0603(1608)  [RESC0603(1608)_L]  (value not drawn)
X1  IDC10  [IDC10M]  (value not drawn)

### Nets
0v: C63.1 C64.1 C65.1 C66.1 C67.1 C68.1 C69.1 C70.1 C71.1 C72.1 C73.1 C74.1 C75.1 C76.1 C77.1 C78.1 C79.1 C80.1 C81.1 C82.1 C83.1 C84.1 C85.1 C86.1 C87.1 C88.1 C89.1 C90.1 C91.1 C92.1 C93.1 C94.1 C95.1 C96.1 C97.1 C98.1 C99.1 C100.1 C101.1 C102.1 C103.1 C104.1 C105.1 C106.1 C107.1 C108.1 C109.1 C110.1 C111.1 C112.1 C113.1 C114.1 C115.1 C116.1 C117.1 C118.1 C119.1 C120.1 C121.1 C122.1 C123.1 C124.1 C125.1 C126.1 C127.1 C128.1 C129.1 C130.1 C131.1 C132.1 C133.1 C134.1 C135.1 C136.1 C137.1 C138.1 C139.1 C140.1 C141.1 C142.1 C250.1 C251.1 C252.1 C253.1 D4.A12(GND) D4.A17(GND) D4.A27(GND) D4.AA1(GND) D4.AA2(GND) D4.AA3(GND) D4.AA4(GND) D4.AA6(GND) D4.AA17(GND) D4.AA27(GND) D4.AB1(GND) D4.AB2(GND) D4.AB5(GND) D4.AB10(GND) D4.AB20(GND) D4.AB30(GND) D4.AC1(GND) D4.AC2(GND) D4.AC3(GND) D4.AC4(GND) D4.AC6(GND) D4.AC13(GND) D4.AC23(GND) D4.AC25(VREFB5AN0) D4.AD1(GND) D4.AD2(GND) D4.AD5(GND) D4.AD7(GND) D4.AD16(GND) D4.AD26(GND) D4.AE1(GND) D4.AE2(GND) D4.AE3(GND) D4.AE4(GND) D4.AE6(GND) D4.AE8(VREFB3AN0) D4.AE9(GND) D4.AE19(GND) D4.AE29(GND) D4.AF1(GND) D4.AF2(GND) D4.AF5(GND) D4.AF12(GND) D4.AF22(GND) D4.AG1(GND) D4.AG2(GND) D4.AG3(GND) D4.AG4(GND) D4.AG15(GND) D4.AG25(GND) D4.AH1(GND) D4.AH2(GND) D4.AH3(GND) D4.AH8(GND) D4.AH18(GND) D4.AH28(GND) D4.AJ6(GND) D4.AJ11(GND) D4.AJ21(GND) D4.AK2(GND) D4.AK14(GND) D4.AK24(GND) D4.AK29(GND) D4.B1(GND) D4.B2(GND) D4.B10(GND) D4.B20(GND) D4.B30(GND) D4.C2(GND) D4.C3(GND) D4.C4(GND) D4.C13(GND) D4.C23(GND) D4.D1(GND) D4.D2(GND) D4.D5(GND) D4.D16(GND) D4.D26(GND) D4.E3(GND) D4.E4(GND) D4.E5(GND) D4.E9(GND) D4.E19(GND) D4.E29(GND) D4.F1(GND) D4.F2(GND) D4.F5(GND) D4.F12(GND) D4.F22(GND) D4.G3(GND) D4.G4(GND) D4.G5(MSEL2) D4.G15(GND) D4.G24(GND) D4.G25(GND) D4.H1(GND) D4.H2(GND) D4.H5(GND) D4.H6(nCE) D4.H8(GND) D4.H11(GND) D4.H18(GND) D4.H28(GND) D4.J3(GND) D4.J4(GND) D4.J6(GND) D4.J11(GND) D4.J21(GND) D4.K1(GND) D4.K2(GND) D4.K5(GND) D4.K9(GND) D4.K14(GND) D4.K24(GND) D4.L1(GND) D4.L2(GND) D4.L3(GND) D4.L4(GND) D4.L6(GND) D4.L17(GND) D4.L27(GND) D4.M1(GND) D4.M2(GND) D4.M5(GND) D4.M10(GND) D4.M14(GND) D4.M16(GND) D4.M18(GND) D4.M20(GND) D4.M26(VREFB6AN0) D4.M30(GND) D4.N1(GND) D4.N2(GND) D4.N3(GND) D4.N4(GND) D4.N6(GND) D4.N7(GND) D4.N8(GND) D4.N13(GND) D4.N15(GND) D4.N17(GND) D4.N19(GND) D4.N23(GND) D4.P1(GND) D4.P2(GND) D4.P5(GND) D4.P7(MSEL3) D4.P8(GND) D4.P11(GND) D4.P14(GND) D4.P16(GND) D4.P18(GND) D4.P26(GND) D4.P27(VREFB5BN0) D4.R1(GND) D4.R2(GND) D4.R3(GND) D4.R4(GND) D4.R6(GND) D4.R7(GND) D4.R8(GND) D4.R9(GND) D4.R13(GND) D4.R15(GND) D4.R17(GND) D4.R19(GND) D4.R29(GND) D4.T1(GND) D4.T2(GND) D4.T5(GND) D4.T8(MSEL0) D4.T12(GND) D4.T14(GND) D4.T16(GND) D4.T18(GND) D4.T20(GND) D4.T22(GND) D4.U1(GND) D4.U2(GND) D4.U3(GND) D4.U4(GND) D4.U6(GND) D4.U13(GND) D4.U15(GND) D4.U17(GND) D4.U19(GND) D4.U25(GND) D4.V1(GND) D4.V2(GND) D4.V5(GND) D4.V8(GND) D4.V14(GND) D4.V16(GND) D4.V18(GND) D4.V20(GND) D4.V23(GND) D4.V28(GND) D4.W1(GND) D4.W2(GND) D4.W3(GND) D4.W4(GND) D4.W6(GND) D4.W7(GND) D4.W8(GND) D4.W11(GND) D4.W13(GND) D4.W15(GND) D4.W17(GND) D4.W19(GND) D4.W21(GND) D4.Y1(GND) D4.Y2(GND) D4.Y5(GND) D4.Y7(GND) D4.Y14(GND) D4.Y24(GND) R33.1 X1.2 X1.10
Fpga_CONF_DONE: D4.L8(CONF_DONE) R31.2
Fpga_Data0: D4.AG5(AS_DATA0,_ASDO,_DATA0)
Fpga_DCLK: D4.T7(DCLK) R32.2
Fpga_nCONFIG: D4.C5(nCONFIG) R30.2
Fpga_nSTATUS: D4.K7(nSTATUS)
TCK: D4.AC7(TCK) R26.2 R33.2 X1.1
TDI: D4.U7(TDI) R27.1 X1.9
TDO: D4.W9(TDO) X1.3
TMS: D4.V7(TMS) R25.2 X1.5
v1p1d: C63.2 C64.2 C65.2 C66.2 C67.2 C68.2 C69.2 C75.2 C76.2 C77.2 C78.2 C79.2 C80.2 C81.2 C87.2 C88.2 C89.2 C90.2 C91.2 C92.2 C93.2 C94.2 D4.AA5(VCC) D4.AC5(VCC) D4.AD6(VCC) D4.J5(VCC) D4.L5(VCC) D4.M6(VCC) D4.M13(VCC) D4.M15(VCC) D4.M17(VCC) D4.M19(VCC) D4.N5(VCC) D4.N14(VCC) D4.N16(VCC) D4.N18(VCC) D4.P13(VCC) D4.P15(VCC) D4.P17(VCC) D4.P19(VCC) D4.R5(VCC) D4.R14(VCC) D4.R16(VCC) D4.R18(VCC) D4.T6(VCC) D4.T13(VCC) D4.T15(VCC) D4.T17(VCC) D4.T19(VCC) D4.U5(VCC) D4.U14(VCC) D4.U16(VCC) D4.U18(VCC) D4.U20(VCC) D4.V13(VCC) D4.V15(VCC) D4.V17(VCC) D4.V19(VCC) D4.W5(VCC) D4.W14(VCC) D4.W16(VCC) D4.W18(VCC) D4.W20(VCC) D4.Y6(VCC)
v1p5d: C111.2 C112.2 C113.2 C114.2 C115.2 C116.2 C117.2 C124.2 C125.2 C126.2 C127.2 C128.2 C129.2 C130.2 C135.2 C136.2 C137.2 C138.2 C250.2 C251.2 C252.2 C253.2 D4.A7(VCCIO8A) D4.A22(VCCIO7A) D4.AA12(VCCIO3B) D4.AB15(VCCIO4A) D4.AC18(VCCIO4A) D4.AD21(VCCIO4A) D4.AE14(VCCIO3B) D4.AF17(VCCIO4A) D4.AG10(VCCIO3B) D4.AG20(VCCIO4A) D4.AH13(VCCIO3B) D4.AH23(VCCIO4A) D4.AJ16(VCCIO4A) D4.AJ26(VCCIO4A) D4.AK4(VCCIO3B) D4.AK9(VCCIO3B) D4.AK19(VCCIO4A) D4.B5(VCCIO8A) D4.B15(VCCIO7A) D4.B25(VCCIO7A) D4.C8(VCCIO8A) D4.C18(VCCIO7A) D4.D11(VCCIO8A) D4.D21(VCCIO7A) D4.E14(VCCIO8A) D4.E24(VCCIO7A) D4.F7(VCCIO8A) D4.F17(VCCIO7A) D4.G10(VCCIO8A) D4.G20(VCCIO7A) D4.H10(VCCBAT) D4.H13(VCCIO8A) D4.H23(VCCIO7A) D4.J16(VCCIO8A) D4.K19(VCCIO7A) D4.L12(VCCIO8A) D4.Y19(VCCIO4A)
v1p8d: L5.2
v2p5d: C97.2 C98.2 C99.2 C100.2 C101.2 C102.2 C103.2 C104.2 C105.2 C106.2 C107.2 C108.2 C122.2 C123.2 C131.2 C132.2 C133.2 C134.2 C139.2 C140.2 C141.2 C142.2 D4.AA22(VCCIO5A) D4.AB11(VCCPD3A) D4.AB25(VCCIO5A) D4.AC12(VCCPD3B4A) D4.AC17(VCCPD3B4A) D4.AC20(VCCPD3B4A) D4.AC28(VCCIO5B) D4.AD10(VCCPD3A) D4.AD15(VCCPD3B4A) D4.AE11(VCCPD3B4A) D4.AE21(VCCPD3B4A) D4.AE24(VCCIO5A) D4.AF27(VCCIO5A) D4.AG30(VCCIO5B) D4.C28(VCCIO6A) D4.D24(VCCPD7A8A) D4.F11(VCCPD7A8A) D4.F21(VCCPD7A8A) D4.F23(VCCPD7A8A) D4.F27(VCCIO6A) D4.G13(VCCPD7A8A) D4.G16(VCCPD7A8A) D4.G19(VCCPD7A8A) D4.G30(VCCIO6A) D4.J26(VCCIO6A) D4.K23(VCCPD6A) D4.K29(VCCIO6A) D4.L22(VCCIO6A) D4.M24(VCCPD6A) D4.M25(VCCIO6A) D4.N28(VCCIO6A) D4.P21(VCCIO6A) D4.P24(VCCPD6A) D4.R24(VCCIO6A) D4.T26(VCCPD5B) D4.T27(VCCIO5B) D4.U24(VCCPD5B) D4.U30(VCCIO5B) D4.W23(VCCPD5A) D4.W25(VCCPD5A) D4.W26(VCCIO5B) D4.Y29(VCCIO5B) L3.2 L4.2
vcc_aux: C82.2 C83.2 C84.2 C85.2 C86.2 D4.AC10(VCC_AUX) D4.AC16(VCC_AUX) D4.AD22(VCC_AUX) D4.G11(VCC_AUX) D4.H16(VCC_AUX) D4.H22(VCC_AUX) L4.1
vcc_pll: C70.2 C71.2 C72.2 C73.2 C74.2 D4.AB6(VCCA_FPLL) D4.AB23(VCCA_FPLL) D4.J8(VCCA_FPLL) D4.J24(VCCA_FPLL) D4.K6(VCCA_FPLL) D4.P6(VCCA_FPLL) D4.V6(VCCA_FPLL) D4.Y8(VCCA_FPLL) L3.1
vccpgm: C95.2 C96.2 C109.2 C110.2 D4.AB24(VCCPGM) D4.AC8(VCCIO3A) D4.AC11(VCCPGM) D4.AD11(VCCIO3A) D4.F10(VCCPGM) D4.U10(VCCIO3A) D4.Y9(VCCIO3A) L5.1 R25.1 R26.1 R27.2 R28.2 R29.2 R30.1 R31.1 R32.1 X1.4
vRefDDR0: C118.2 C119.2 D4.AH16(VREFB4AN0) D4.AJ13(VREFB3BN0)
vRefDDR1: C120.2 C121.2 D4.B9(VREFB8AN0) D4.B16(VREFB7AN0)
NetD4_M7: D4.M7(MSEL4) R29.1
NetD4_P9: D4.P9(MSEL1) R28.1

Not connected (* = marked no-connect by the designer): D4 AA7(nCSO,_DATA4) AB7(AS_DATA3,_DATA3) AE5(AS_DATA1,_DATA1) AE7(AS_DATA2,_DATA2); X1 6 7 8

### Notes on the sheet
- TCK
- GND
- TDO
- Vcc(target)
- TMS
- NC
- TDI
- Title
- Size:
- Date:
- File:
- A2
- Number:
- Time:
- Revision:
- Sheet
- of
- (in symbol IDC10) PIN; WIRE

### Library data of the parts
C63-C142 C250-C253 = CAP_0402: CAP 1uF 10V ±20% 0402 (1005 Metric) Thickness 0.6mm SMD; Case-Metric: 1005; Case-EIA: 0402; Value: 0.1; Tolerance: ±20%; Max Thickness: 0.6 mm; Rated Voltage: 10 V; Technology: SMT
D4 = 5CEFA7F31C8N: as D4 on sheet as14120_x31_fpga_ttl; DatasheetVersion: Rev. 3.1; PackageReference: 896-FBGA-2000A; PackageDescription: 896-Pin FineLine Ball-Grid Array (FBGA), Body 31 x 31 mm, Pitch 1 mm; Supplier 1: Digi-Key; Supplier Part Number 1: 544-2768-ND; Supplier 2: Mouser; Supplier Part Number 2: 989-5CEFA7F31C8N; RoHS: RoHS Compliant; Subcategory: Cyclone V E; Voltage Supply: 1.07 to 1.13 V; Mounting Technology: Surface Mount; Code_JEDEC: MS-034-AAN-1; PartNumber: 5CEFA7F31C8N; ComponentLink1Description: Manufacturer URL; ComponentLink1URL: http://www.altera.com; ComponentLink2Description: Datasheet; ComponentLink2URL: http://www.altera.com/literature/hb/cyclone-v/cv_51002.pdf; ComponentLink3Description: Package Specification; ComponentLink3URL: http://www.altera.com/devicepackaging/04R00435-01.pdf; ComponentLink4Description: Device Handbook URL; ComponentLink4URL: http://www.altera.com/literature/hb/cyclone-v/cyclone5_handbook.pdf; ComponentLink5Description: Device Overview URL; ComponentLink5URL: http://www.altera.com/literature/hb/cyclone-v/cv_51001.pdf; ComponentLink6Description: Device Pin-Out URL; ComponentLink6URL: http://www.altera.com/literature/dp/cyclone-v/1.1.txt; ComponentLink7Description: Product URL; ComponentLink7URL: http://www.buyaltera.com/scripts/partsearch.dll?Detail&name=5CEFA7F31C8N-ND
L3-L5 = Ferrite_beat
R25-R27 R30-R32 = RES_0603: 1K 0.1W 5% 0603 (1608 Metric)  SMD; Case-EIA: 0603; Case-Metric: 1608; Value: 10k; Technology: SMT; Tolerance: 5 %; Power: 0.1 W
R28 R29 R33 = RES_0603: as R59 on sheet as14120_x31_usb; Technology: SMT; Tolerance: 5 %; Power: 0.1 W
  R33: Value: 1k
X1 = IDC10: Value: *